# Altium schematic sheet VS1005-Pico_2024-02-05.schdoc
size 539 x 349 mm
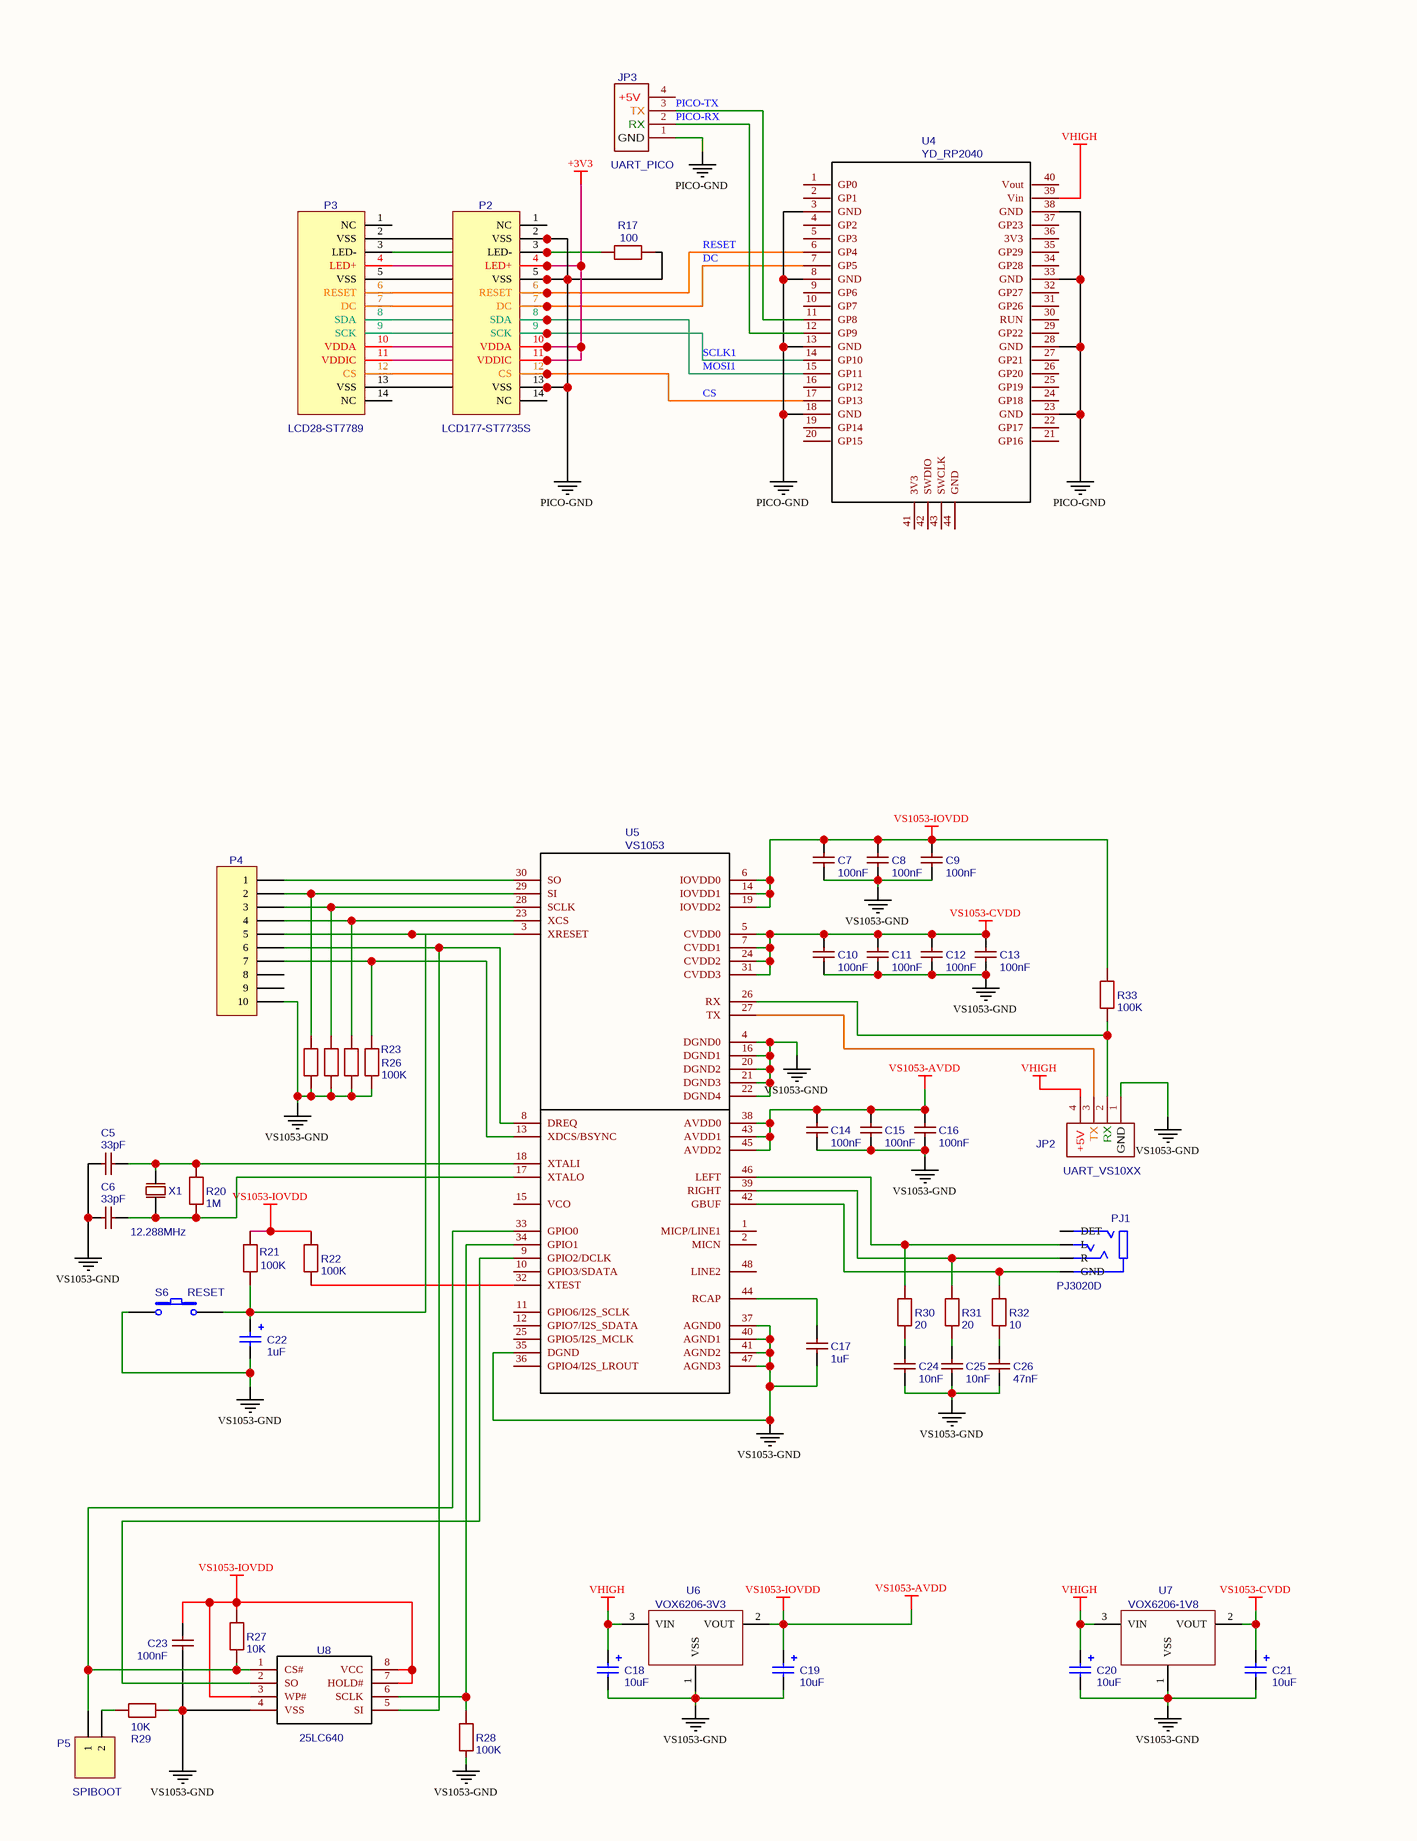
[diagram p0: VS1005-Pico_2024-02-05.schdoc, left]
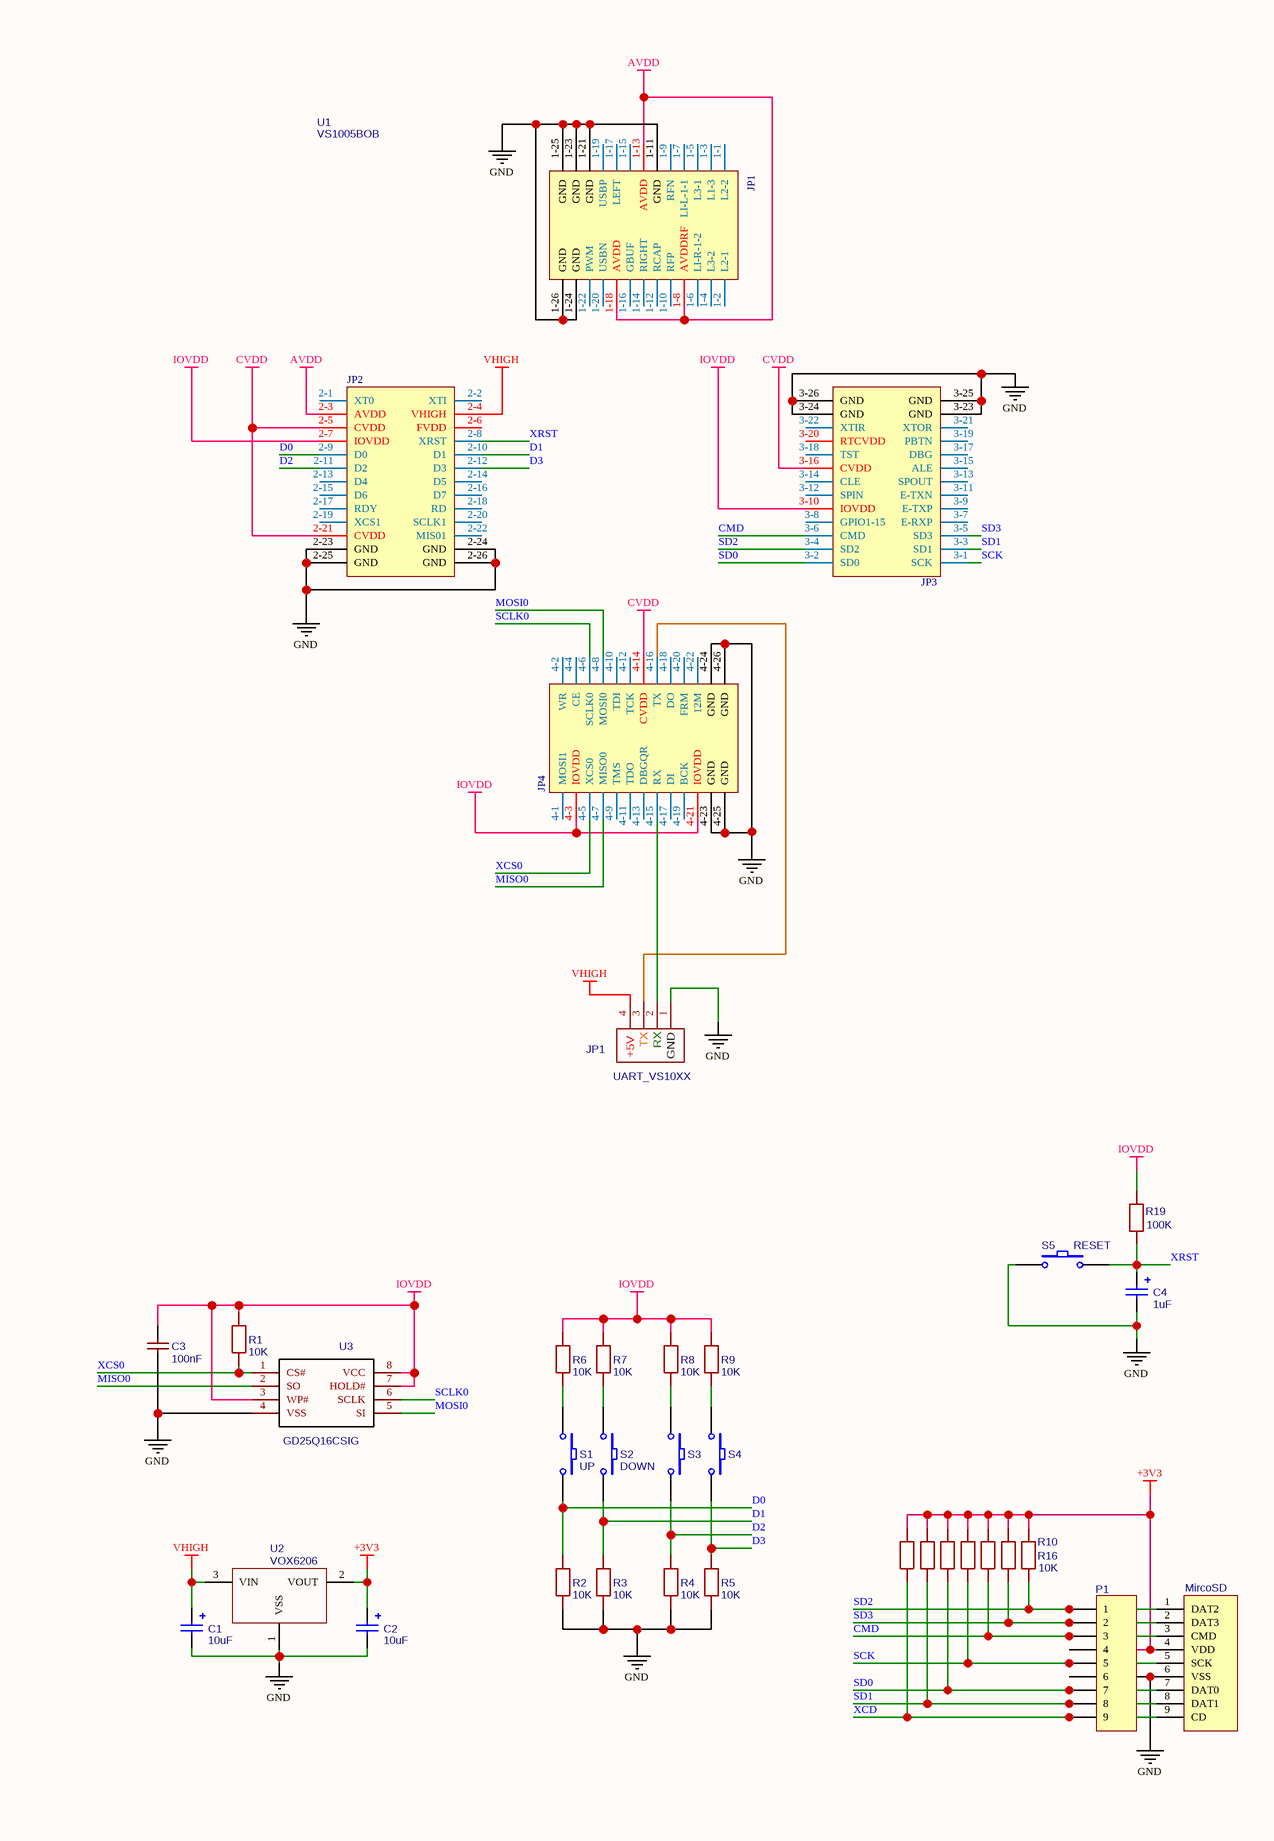
[diagram p1: VS1005-Pico_2024-02-05.schdoc, right]

## Parts
C1  10uF  [CAP-DIP]
C2  10uF  [CAP-DIP]
C3  100nF  [CAP-0805]
C4  1uF  [CAP-DIP]
C5  33pF  [CAP-0805]
C6  33pF  [CAP-0805]
C7  100nF  [CAP-0805]
C8  100nF  [CAP-0805]
C9  100nF  [CAP-0805]
C10  100nF  [CAP-0805]
C11  100nF  [CAP-0805]
C12  100nF  [CAP-0805]
C13  100nF  [CAP-0805]
C14  100nF  [CAP-0805]
C15  100nF  [CAP-0805]
C16  100nF  [CAP-0805]
C17  1uF  [CAP-0805]
C18  10uF  [CAP-DIP]
C19  10uF  [CAP-DIP]
C20  10uF  [CAP-DIP]
C21  10uF  [CAP-DIP]
C22  1uF  [CAP-DIP]
C23  100nF  [CAP-0805]
C24  10nF  [CAP-0805]
C25  10nF  [CAP-0805]
C26  47nF  [CAP-0805]
JP1  UART_VS10XX  [UART_VS10XX]
JP2  UART_VS10XX  [UART_VS10XX]
JP3  UART_PICO  [UART_VS10XX]
P1  Header 9  [HDR1X9]  (value not drawn)
P2  LCD177-ST7735S  [LCD177]
P3  LCD28-ST7789  [HDR2X7]
P4  Header 10  [HDR1X10]  (value not drawn)
P5  SPIBOOT  [HDR1X2]
P6  MircoSD  [MICROSD]
PJ1  PJ3020D  [PJ3020D]
R1  10K  [RES-0805]
R2  10K  [RES-0805]
R3  10K  [RES-0805]
R4  10K  [RES-0805]
R5  10K  [RES-0805]
R6  10K  [RES-0805]
R7  10K  [RES-0805]
R8  10K  [RES-0805]
R9  10K  [RES-0805]
R10  10K  [RES-0805]  (value not drawn)
R11  10K  [RES-0805]  (value not drawn)
R12  10K  [RES-0805]  (value not drawn)
R13  10K  [RES-0805]  (value not drawn)
R14  10K  [RES-0805]  (value not drawn)
R15  10K  [RES-0805]  (value not drawn)
R16  10K  [RES-0805]
R17  100  [RES-0805]
R19  100K  [RES-0805]
R20  1M  [RES-0805]
R21  100K  [RES-0805]
R22  100K  [RES-0805]
R23  100K  [RES-0805]  (value not drawn)
R24  100K  [RES-0805]  (value not drawn)
R25  100K  [RES-0805]  (value not drawn)
R26  100K  [RES-0805]
R27  10K  [RES-0805]
R28  100K  [RES-0805]
R29  10K  [RES-0805]
R30  20  [RES-0805]
R31  20  [RES-0805]
R32  10  [RES-0805]
R33  100K  [RES-0805]
S1  UP  [SW-4.5]
S2  DOWN  [SW-4.5]
S3  D2  [SW-4.5]  (value not drawn)
S4  D3  [SW-4.5]  (value not drawn)
S5  RESET  [SW-4.5]
S6  RESET  [SW-4.5]
U1  VS1005BOB  [VS1005BOB]
U2  VOX6206  [VOX6206]
U3  GD25Q16CSIG  [SOIC-8_L5.3-W5.3-P1.27-LS8.0-BL]
U4  YD_RP2040  [YD-RP2040]
U5  VS1053  [LQFP-48-VS1053]
U6  VOX6206-3V3  [VOX6206]
U7  VOX6206-1V8  [VOX6206]
U8  25LC640  [SOIC-8_L5.3-W5.3-P1.27-LS8.0-BL]
X1  12.288MHz  [CRYSTAL-TH_BD2.0-L6.0-P1.27]

## Nets
+3V3: C2.1 P1.4 P2.4(LED+) P2.10(VDDA) P2.11(VDDIC) P3.4(LED+) P3.10(VDDA) P3.11(VDDIC) P6.4(VDD) R10.2 R11.2 R12.2 R13.2 R14.2 R15.2 R16.2 U2.2(VOUT)
AVDD: U1.1-8(AVDDRF) U1.1-13(AVDD) U1.1-18(AVDD) U1.2-3(AVDD)
CVDD: U1.2-5(CVDD) U1.2-21(CVDD) U1.3-16(CVDD) U1.4-14(CVDD)
GND: C1.2 C2.2 C3.2 C4.2 JP1.1 P1.6 P6.6(VSS) R2.1 R3.1 R4.1 R5.1 S5.1 U1.1-11(GND) U1.1-21(GND) U1.1-23(GND) U1.1-24(GND) U1.1-25(GND) U1.1-26(GND) U1.2-23(GND) U1.2-24(GND) U1.2-25(GND) U1.2-26(GND) U1.3-23(GND) U1.3-24(GND) U1.3-25(GND) U1.3-26(GND) U1.4-23(GND) U1.4-24(GND) U1.4-25(GND) U1.4-26(GND) U2.1(VSS) U3.4(VSS)
IOVDD: C3.1 R1.2 R6.2 R7.2 R8.2 R9.2 R19.2 U1.2-7(IOVDD) U1.3-10(IOVDD) U1.4-3(IOVDD) U1.4-21(IOVDD) U3.3(WP#) U3.7(HOLD#) U3.8(VCC)
PICO-GND: JP3.1 P2.2(VSS) P2.5(VSS) P2.13(VSS) P3.2(VSS) P3.5(VSS) P3.13(VSS) R17.1 U4.3(GND) U4.8(GND) U4.13(GND) U4.18(GND) U4.23(GND) U4.28(GND) U4.33(GND) U4.38(GND)
VHIGH: C1.1 C18.1 C20.1 JP1.4 JP2.4 U1.2-4(VHIGH) U2.3(VIN) U4.39(Vin) U6.3(VIN) U7.3(VIN)
VS1053-AVDD: C7.1 C8.1 C9.1 C14.1 C15.1 C16.1 C19.1 C23.1 R21.2 R22.2 R27.2 R33.2 U5.6(IOVDD0) U5.14(IOVDD1) U5.19(IOVDD2) U5.38(AVDD0) U5.43(AVDD1) U5.45(AVDD2) U6.2(VOUT) U8.3(WP#) U8.7(HOLD#) U8.8(VCC)  [also labelled VS1053-IOVDD]
VS1053-CVDD: C10.1 C11.1 C12.1 C13.1 C21.1 U5.5(CVDD0) U5.7(CVDD1) U5.24(CVDD2) U5.31(CVDD3) U7.2(VOUT)
VS1053-GND: C5.2 C6.2 C7.2 C8.2 C9.2 C10.2 C11.2 C12.2 C13.2 C14.2 C15.2 C16.2 C17.2 C18.2 C19.2 C20.2 C21.2 C22.2 C23.2 C24.2 C25.2 C26.2 JP2.1 P4.10 R23.1 R24.1 R25.1 R26.1 R28.1 R29.1 S6.1 U5.4(DGND0) U5.16(DGND1) U5.20(DGND2) U5.21(DGND3) U5.22(DGND4) U5.35(DGND) U5.37(AGND0) U5.40(AGND1) U5.41(AGND2) U5.47(AGND3) U6.1(VSS) U7.1(VSS) U8.4(VSS)
CMD: P1.3 P6.3(CMD) R14.1 U1.3-6(CMD)
CS: P2.12(CS) P3.12(CS) U4.17(GP13)
D0: R2.2 S1.2 U1.2-9(D0)
D1: R3.2 S2.2 U1.2-10(D1)
D2: R4.2 S3.2 U1.2-11(D2)
D3: R5.2 S4.2 U1.2-12(D3)
DC: P2.7(DC) P3.7(DC) U4.7(GP5)
MISO0: U1.4-7(MISO0) U3.2(SO)
MOSI0: U1.4-8(MOSI0) U3.5(SI)
MOSI1: P2.8(SDA) P3.8(SDA) U4.15(GP11)
PICO-RX: JP3.2 U4.12(GP9)
PICO-TX: JP3.3 U4.11(GP8)
RESET: P2.6(RESET) P3.6(RESET) U4.6(GP4)
SCK: P1.5 P6.5(SCK) R13.1 U1.3-1(SCK)
SCLK0: U1.4-6(SCLK0) U3.6(SCLK)
SCLK1: P2.9(SCK) P3.9(SCK) U4.14(GP10)
SD0: P1.7 P6.7(DAT0) R12.1 U1.3-2(SD0)
SD1: P1.8 P6.8(DAT1) R11.1 U1.3-3(SD1)
SD2: P1.1 P6.1(DAT2) R16.1 U1.3-4(SD2)
SD3: P1.2 P6.2(DAT3) R15.1 U1.3-5(SD3)
XCD: P1.9 P6.9(CD) R10.1
XCS0: R1.1 U1.4-5(XCS0) U3.1(CS#)
XRST: C4.1 R19.1 S5.2 U1.2-8(XRST)
NetC5_1: C5.1 R20.2 U5.18(XTALI) X1.2
NetC6_1: C6.1 R20.1 U5.17(XTALO) X1.1
NetC17_1: C17.1 U5.44(RCAP)
NetC22_1: C22.1 P4.5 R21.1 S6.2 U5.3(XRESET)
NetC24_1: C24.1 R30.1
NetC25_1: C25.1 R31.1
NetC26_1: C26.1 R32.1
NetJP1_2: JP1.2 U1.4-15(RX)
NetJP1_3: JP1.3 U1.4-16(TX)
NetJP2_2: JP2.2 R33.1 U5.26(RX)
NetJP2_3: JP2.3 U5.27(TX)
NetP2_3: P2.3(LED-) P3.3(LED-) R17.2
NetP4_1: P4.1 U5.30(SO)
NetP4_2: P4.2 R23.2 U5.29(SI)
NetP4_3: P4.3 R24.2 U5.28(SCLK)
NetP4_4: P4.4 R25.2 U5.23(XCS)
NetP4_6: P4.6 U5.8(DREQ) U8.5(SI)
NetP4_7: P4.7 R26.2 U5.13(XDCS/BSYNC)
NetP5_1: P5.1 R27.1 U5.33(GPIO0) U8.1(CS#)
NetP5_2: P5.2 R29.2
NetPJ1_3: PJ1.3(R) R31.2 U5.39(RIGHT)
NetPJ1_4: PJ1.4(L) R30.2 U5.46(LEFT)
NetPJ1_5: PJ1.5(GND) R32.2 U5.42(GBUF)
NetR6_1: R6.1 S1.1
NetR7_1: R7.1 S2.1
NetR8_1: R8.1 S3.1
NetR9_1: R9.1 S4.1
NetR22_1: R22.1 U5.32(XTEST)
NetR28_2: R28.2 U5.34(GPIO1) U8.6(SCLK)
NetU5_9: U5.9(GPIO2/DCLK) U8.2(SO)

Not connected (* = marked no-connect by the designer): JP3 4; P2 1(NC) 14(NC); P3 1(NC) 14(NC); P4 8 9; PJ1 2(DET); U1 1-1(L2-2) 1-2(L2-1) 1-3(L1-3) 1-4(L3-2) 1-5(L3-1) 1-6(LI-R-1-2) 1-7(LI-L-1-1) 1-9(RFN) 1-10(RFP) 1-12(RCAP) 1-14(RIGHT) 1-15 1-16(GBUF) 1-17(LEFT) 1-19(USBP) 1-20(USBN) 1-22(PWM) 2-1(XT0) 2-2(XTI) 2-6(FVDD) 2-13(D4) 2-14(D5) 2-15(D6) 2-16(D7) 2-17(RDY) 2-18(RD) 2-19(XCS1) 2-20(SCLK1) 2-22(MIS01) 3-7(E-RXP) 3-8(GPIO1-15) 3-9(E-TXP) 3-11(E-TXN) 3-12(SPIN) 3-13(SPOUT) 3-14(CLE) 3-15(ALE) 3-17(DBG) 3-18(TST) 3-19(PBTN) 3-20(RTCVDD) 3-21(XTOR) 3-22(XTIR) 4-1(MOSI1) 4-2(WR) 4-4(CE) 4-9(TMS) 4-10(TDI) 4-11(TDO) 4-12(TCK) 4-13(DBGQR) 4-17(DI) 4-18(DO) 4-19(BCK) 4-20(FRM) 4-22(12M); U4 1(GP0) 2(GP1) 4(GP2) 5(GP3) 9(GP6) 10(GP7) 16(GP12) 19(GP14) 20(GP15) 21(GP16) 22(GP17) 24(GP18) 25(GP19) 26(GP20) 27(GP21) 29(GP22) 30(RUN) 31(GP26) 32(GP27) 34(GP28) 35(GP29) 36(3V3) 37(GP23) 40(Vout) 41(3V3) 42(SWDIO) 43(SWCLK) 44(GND); U5 1(MICP/LINE1) 2(MICN) 10(GPIO3/SDATA) 11(GPIO6/I2S_SCLK) 12(GPIO7/I2S_SDATA) 15(VCO) 25(GPIO5/I2S_MCLK) 36(GPIO4/I2S_LROUT) 48(LINE2)

## Notes on the sheet
- (in symbol UART_PICO) +5V; TX; RX; GND
- (in symbol UART_VS10XX) TX; RX; +5V; GND
- (in symbol VS1005BOB) JP1; JP2; JP3; JP4

## Library data of the parts
C1 C2 C18-C21 = 10uF: Contributor: kmok163; Published: 8-Jun-2000; LatestRevisionDate: 17-Jul-2002; LatestRevisionNote: Re-released for DXP Platform.; PackageReference: RAD-0.3; Publisher: Altium Limited; spicePre: C; spiceSymbolName: 10uF
C3 C7-C16 C23 = 100nF: Manufacturer Part: CC0805KRX7R9BB104; Manufacturer: YAGEO; nameAlias: Capacitance; SMT Type: Basic; Contributor: fen-1; Supplier: LCSC; LCSC Assembly: Yes; Supplier Part: C49678; spicePre: C; spiceSymbolName: CAP-0805
C4 C22 = 1uF: Contributor: kmok163; Published: 8-Jun-2000; LatestRevisionDate: 17-Jul-2002; LatestRevisionNote: Re-released for DXP Platform.; PackageReference: RAD-0.3; Publisher: Altium Limited; spicePre: C; spiceSymbolName: 10uF
C5 C6 = 33pF: Manufacturer Part: CC0805KRX7R9BB104; Manufacturer: YAGEO; nameAlias: Capacitance; SMT Type: Basic; Contributor: fen-1; Supplier: LCSC; LCSC Assembly: Yes; Supplier Part: C49678; spicePre: C; spiceSymbolName: CAP-0805
C17 = 1uF: Manufacturer Part: CC0805KRX7R9BB104; Manufacturer: YAGEO; nameAlias: Capacitance; SMT Type: Basic; Contributor: fen-1; Supplier: LCSC; LCSC Assembly: Yes; Supplier Part: C49678; spicePre: C; spiceSymbolName: CAP-0805
C24 C25 = 10nF: Manufacturer Part: CC0805KRX7R9BB104; Manufacturer: YAGEO; nameAlias: Capacitance; SMT Type: Basic; Contributor: fen-1; Supplier: LCSC; LCSC Assembly: Yes; Supplier Part: C49678; spicePre: C; spiceSymbolName: CAP-0805
C26 = 47nF: Manufacturer Part: CC0805KRX7R9BB104; Manufacturer: YAGEO; nameAlias: Capacitance; SMT Type: Basic; Contributor: fen-1; Supplier: LCSC; LCSC Assembly: Yes; Supplier Part: C49678; spicePre: C; spiceSymbolName: CAP-0805
JP1 JP2 = UART_VS10XX: description: Header 4; Contributor: SparkFun; spicePre: J; spiceSymbolName: UART_VS10XX
JP3 = UART_PICO: description: Header 4; Contributor: SparkFun; spicePre: J; spiceSymbolName: UART_VS10XX
P1 = Header 9: Contributor: kmok163; LatestRevisionDate: 17-Jul-2002; LatestRevisionNote: Re-released for DXP Platform.; Publisher: Altium Limited; spicePre: P; spiceSymbolName: Header 9
P2 = LCD177-ST7735S: Contributor: kmok163; Revision: 17-Jul-2002: Re-released for DXP Platform.; Publisher: Altium Limited; spicePre: P; spiceSymbolName: LCD 1.77
P3 = LCD28-ST7789: Contributor: kmok163; Revision: 17-Jul-2002: Re-released for DXP Platform.; Publisher: Altium Limited; spicePre: P; spiceSymbolName: LCD 1.77
P4 = Header 10: Contributor: kmok163; LatestRevisionDate: 17-Jul-2002; LatestRevisionNote: Re-released for DXP Platform.; Publisher: Altium Limited; spicePre: P; spiceSymbolName: Header 10
P5 = SPIBOOT: Contributor: kmok163; LatestRevisionDate: 17-Jul-2002; LatestRevisionNote: Re-released for DXP Platform.; Publisher: Altium Limited; spicePre: P; spiceSymbolName: Header 2
P6 = MircoSD: Contributor: kmok163; LatestRevisionDate: 17-Jul-2002; LatestRevisionNote: Re-released for DXP Platform.; Publisher: Altium Limited; spicePre: T; spiceSymbolName: TF
PJ1 = PJ3020D: Contributor: 爱迪声DTS音响; spicePre: P; spiceSymbolName: PJ3020D
R1-R16 R27 R29 = 10K: Contributor: EDAUSER001; spicePre: R; spiceSymbolName: RES_0805
R17 = 100: Contributor: EDAUSER001; spicePre: R; spiceSymbolName: RES_0805
R19 R21-R26 R28 R33 = 100K: Contributor: EDAUSER001; spicePre: R; spiceSymbolName: RES_0805
R20 = 1M: Contributor: EDAUSER001; spicePre: R; spiceSymbolName: RES_0805
R30 R31 = 20: Contributor: EDAUSER001; spicePre: R; spiceSymbolName: RES_0805
R32 = 10: Contributor: EDAUSER001; spicePre: R; spiceSymbolName: RES_0805
S1 = UP: Contributor: kmok163; Published: 24-Mar-1999; Revision: July-2002: Re-released for DXP Platform.; Publisher: Altium Limited; spicePre: S; spiceSymbolName: reset
S2 = DOWN: Contributor: kmok163; Published: 24-Mar-1999; Revision: July-2002: Re-released for DXP Platform.; Publisher: Altium Limited; spicePre: S; spiceSymbolName: reset
S3 = D2: Contributor: kmok163; Published: 24-Mar-1999; Revision: July-2002: Re-released for DXP Platform.; Publisher: Altium Limited; spicePre: S; spiceSymbolName: reset
S4 = D3: Contributor: kmok163; Published: 24-Mar-1999; Revision: July-2002: Re-released for DXP Platform.; Publisher: Altium Limited; spicePre: S; spiceSymbolName: reset
S5 S6 = RESET: Contributor: kmok163; Published: 24-Mar-1999; Revision: July-2002: Re-released for DXP Platform.; Publisher: Altium Limited; spicePre: S; spiceSymbolName: reset
U1 = VS1005BOB: Manufacturer: VLSI Solution Oy; Contributor: kmok163; spicePre: U; spiceSymbolName: VS1005BOB; Manufacturer Part: VS1005BOB
U2 = VOX6206: Contributor: kmok163; Published: 8-Jun-2000; Publisher: Altium Limited; LatestRevisionDate: 15-Jan-2003; LatestRevisionNote: PCB Footprint 'BCY-W3/D4.7' replaced; DatasheetDocument: 1997; PackageDocument: Sep-1998; PackageReference: TO-92A; Code_JEDEC: TO-92A; ComponentLink1Description: Manufacturer Link; ComponentLink1URL: http://www.fairchildsemi.com/; ComponentLink2Description: Datasheet; ComponentLink2URL: http://www.fairchildsemi.com/ds/2N%2F2N3904.pdf; spicePre: I; spiceSymbolName: VOX6206
U3 = GD25Q16CSIG: Manufacturer: GigaDevice(兆易创新); Supplier: LCSC; Manufacturer Part: GD25Q16CSIG; Supplier Part: C79074; JLCPCB Part Class: Extended Part; spicePre: U; spiceSymbolName: GD25Q16CSIG
U4 = YD_RP2040: Contributor: armxu; spicePre: U; spiceSymbolName: YD_RP2040
U5 = VS1053: Manufacturer: VLSI Solution Oy; Contributor: kmok163; Manufacturer Part: VS1053; spicePre: U; spiceSymbolName: VS1053
U6 = VOX6206-3V3: Contributor: kmok163; Published: 8-Jun-2000; Publisher: Altium Limited; LatestRevisionDate: 15-Jan-2003; LatestRevisionNote: PCB Footprint 'BCY-W3/D4.7' replaced; DatasheetDocument: 1997; PackageDocument: Sep-1998; PackageReference: TO-92A; Code_JEDEC: TO-92A; ComponentLink1Description: Manufacturer Link; ComponentLink1URL: http://www.fairchildsemi.com/; ComponentLink2Description: Datasheet; ComponentLink2URL: http://www.fairchildsemi.com/ds/2N%2F2N3904.pdf; spicePre: I; spiceSymbolName: VOX6206
U7 = VOX6206-1V8: Contributor: kmok163; Published: 8-Jun-2000; Publisher: Altium Limited; LatestRevisionDate: 15-Jan-2003; LatestRevisionNote: PCB Footprint 'BCY-W3/D4.7' replaced; DatasheetDocument: 1997; PackageDocument: Sep-1998; PackageReference: TO-92A; Code_JEDEC: TO-92A; ComponentLink1Description: Manufacturer Link; ComponentLink1URL: http://www.fairchildsemi.com/; ComponentLink2Description: Datasheet; ComponentLink2URL: http://www.fairchildsemi.com/ds/2N%2F2N3904.pdf; spicePre: I; spiceSymbolName: VOX6206
U8 = 25LC640: Manufacturer: GigaDevice(兆易创新); Manufacturer Part: GD25Q16CSIG; Supplier: LCSC; Supplier Part: C79074; JLCPCB Part Class: Extended Part; spicePre: U; spiceSymbolName: GD25Q16CSIG
X1 = 12.288MHz: Manufacturer: EPSON(爱普生); Manufacturer Part: C-2 96.0000K-P:PBFREE; Contributor: lcsc; nameAlias: Value; Supplier: LCSC; Supplier Part: C1669736; JLCPCB Part Class: Extended Part; spicePre: U; spiceSymbolName: C-2 96.0000K-P:PBFREE